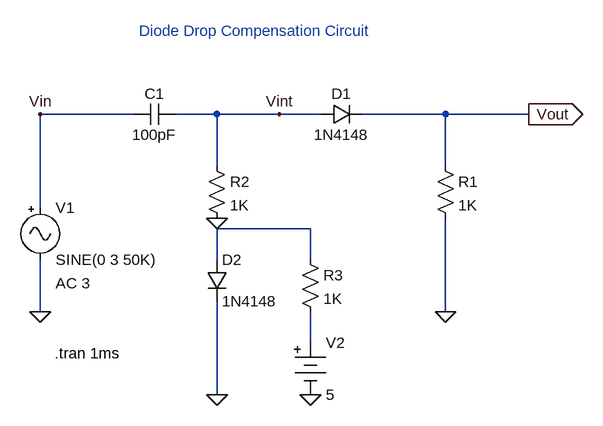
[diagram p0: schematic 9. Diode Compensation.asc]
9. Diode Compensation.asc, the LTspice schematic file:
Version 4
SHEET 1 880 680
WIRE 16 112 -128 112
WIRE 144 112 80 112
WIRE 240 112 144 112
WIRE 304 112 240 112
WIRE 496 112 368 112
WIRE 624 112 496 112
WIRE 144 192 144 112
WIRE 496 192 496 112
WIRE -128 256 -128 112
WIRE 288 288 144 288
WIRE 144 336 144 288
WIRE 288 336 288 288
WIRE -128 416 -128 336
WIRE 496 416 496 272
WIRE 288 464 288 416
WIRE 144 544 144 400
FLAG 496 416 0
FLAG -128 416 0
FLAG 624 112 Vout
IOPIN 624 112 Out
FLAG 144 544 0
FLAG 288 544 0
FLAG 240 112 Vint
FLAG -128 112 Vin
FLAG 144 272 0
SYMBOL cap 80 96 R90
WINDOW 0 0 32 VBottom 2
WINDOW 3 32 32 VTop 2
SYMATTR InstName C1
SYMATTR Value 100pF
SYMBOL diode 304 128 R270
WINDOW 0 32 32 VTop 2
WINDOW 3 0 32 VBottom 2
SYMATTR InstName D1
SYMATTR Value 1N4148
SYMBOL res 480 176 R0
SYMATTR InstName R1
SYMATTR Value 1K
SYMBOL res 128 176 R0
SYMATTR InstName R2
SYMATTR Value 1K
SYMBOL Misc\\signal -128 240 R0
WINDOW 123 24 132 Left 2
WINDOW 39 0 0 Left 0
SYMATTR InstName V1
SYMATTR Value SINE(0 3 50K)
SYMATTR Value2 AC 3
SYMBOL diode 128 336 R0
SYMATTR InstName D2
SYMATTR Value 1N4148
SYMBOL res 272 320 R0
SYMATTR InstName R3
SYMATTR Value 1K
SYMBOL Misc\\battery 288 448 R0
WINDOW 123 0 0 Left 0
WINDOW 39 0 0 Left 0
SYMATTR InstName V2
SYMATTR Value 5
TEXT -106 480 Left 2 !.tran 1ms
TEXT 24 -16 Left 2 ;Diode Drop Compensation Circuit

The netlist it stands for:
* 9. Diode Compensation.asc
C1 Vint Vin 100pF
D1 Vint Vout 1N4148
R1 Vout 0 1K
R2 Vint 0 1K
V1 Vin 0 SINE(0 3 50K) AC 3
D2 N001 0 1N4148
R3 N001 N002 1K
V2 N002 0 5
.model D D
.lib standard.dio
.tran 1ms
* Diode Drop Compensation Circuit
.backanno
.end